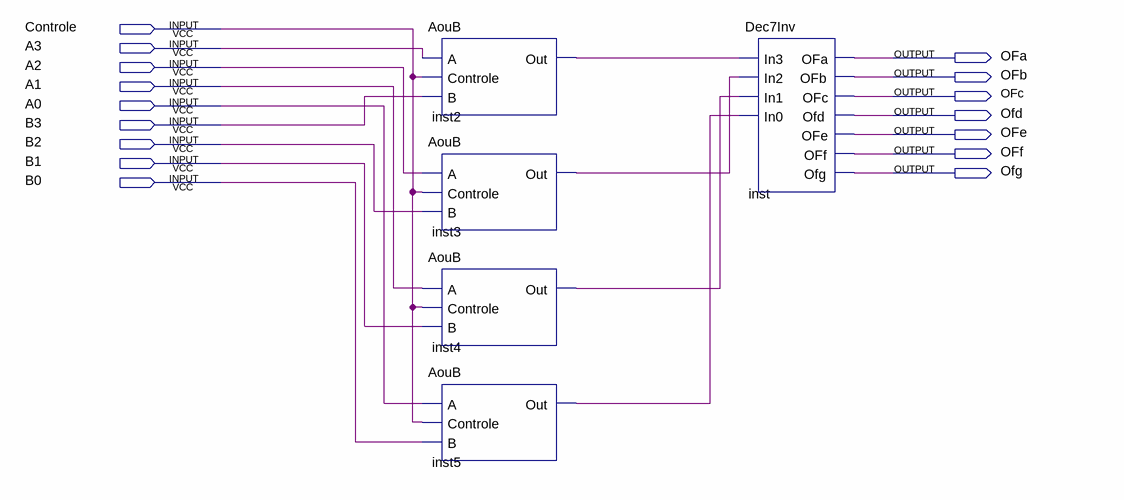
[diagram p0: schematic sheet]
// Quartus schematic AorB_Dec7.bdf as structural Verilog: 5 symbols, 16 pins
module AorB_Dec7 (
  input  Controle,
  input  A3,
  input  A2,
  input  A1,
  input  A0,
  input  B3,
  input  B2,
  input  B1,
  input  B0,
  output OFa,
  output OFb,
  output OFc,
  output Ofd,
  output OFe,
  output OFf,
  output Ofg
);

  wire inst2_out, inst3_out, inst4_out, inst5_out;

  AouB inst2 (.A(A3), .Controle(Controle), .B(B3), .Out(inst2_out));
  AouB inst3 (.A(A2), .Controle(Controle), .B(B2), .Out(inst3_out));
  AouB inst4 (.A(A1), .Controle(Controle), .B(B1), .Out(inst4_out));
  AouB inst5 (.A(A0), .Controle(Controle), .B(B0), .Out(inst5_out));
  Dec7Inv inst (
    .In3(inst2_out), .In2(inst3_out), .In1(inst4_out), .In0(inst5_out), .OFa(OFa), .OFb(OFb), .OFc(OFc),
    .Ofd(Ofd), .OFe(OFe), .OFf(OFf), .Ofg(Ofg));
endmodule
